# Altium schematic sheet LCO_Size_B.SchDoc: Las Cumbres
size B; DrawnBy: John Doe; Organization: Las Cumbres Observatoy; Address1: 6740 Cortona Dr.; Address2: Suite 102; Address3: Goleta, CA 93117; DocumentNumber: 1; Revision: 1; SheetNumber: 1; SheetTotal: 1000's
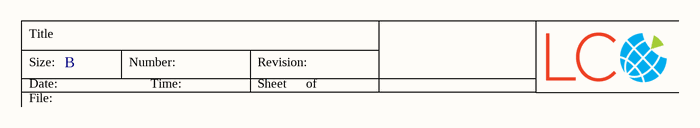
[diagram p0: LCO_Size_B.SchDoc]

## Notes on the sheet
- Title
- Size:
- Date:
- B
- Number:
- Time:
- Revision:
- Sheet
- of
- File: